# EAGLE design ARP Odyssey VCO 1.3 (EAGLE 7.7.0)
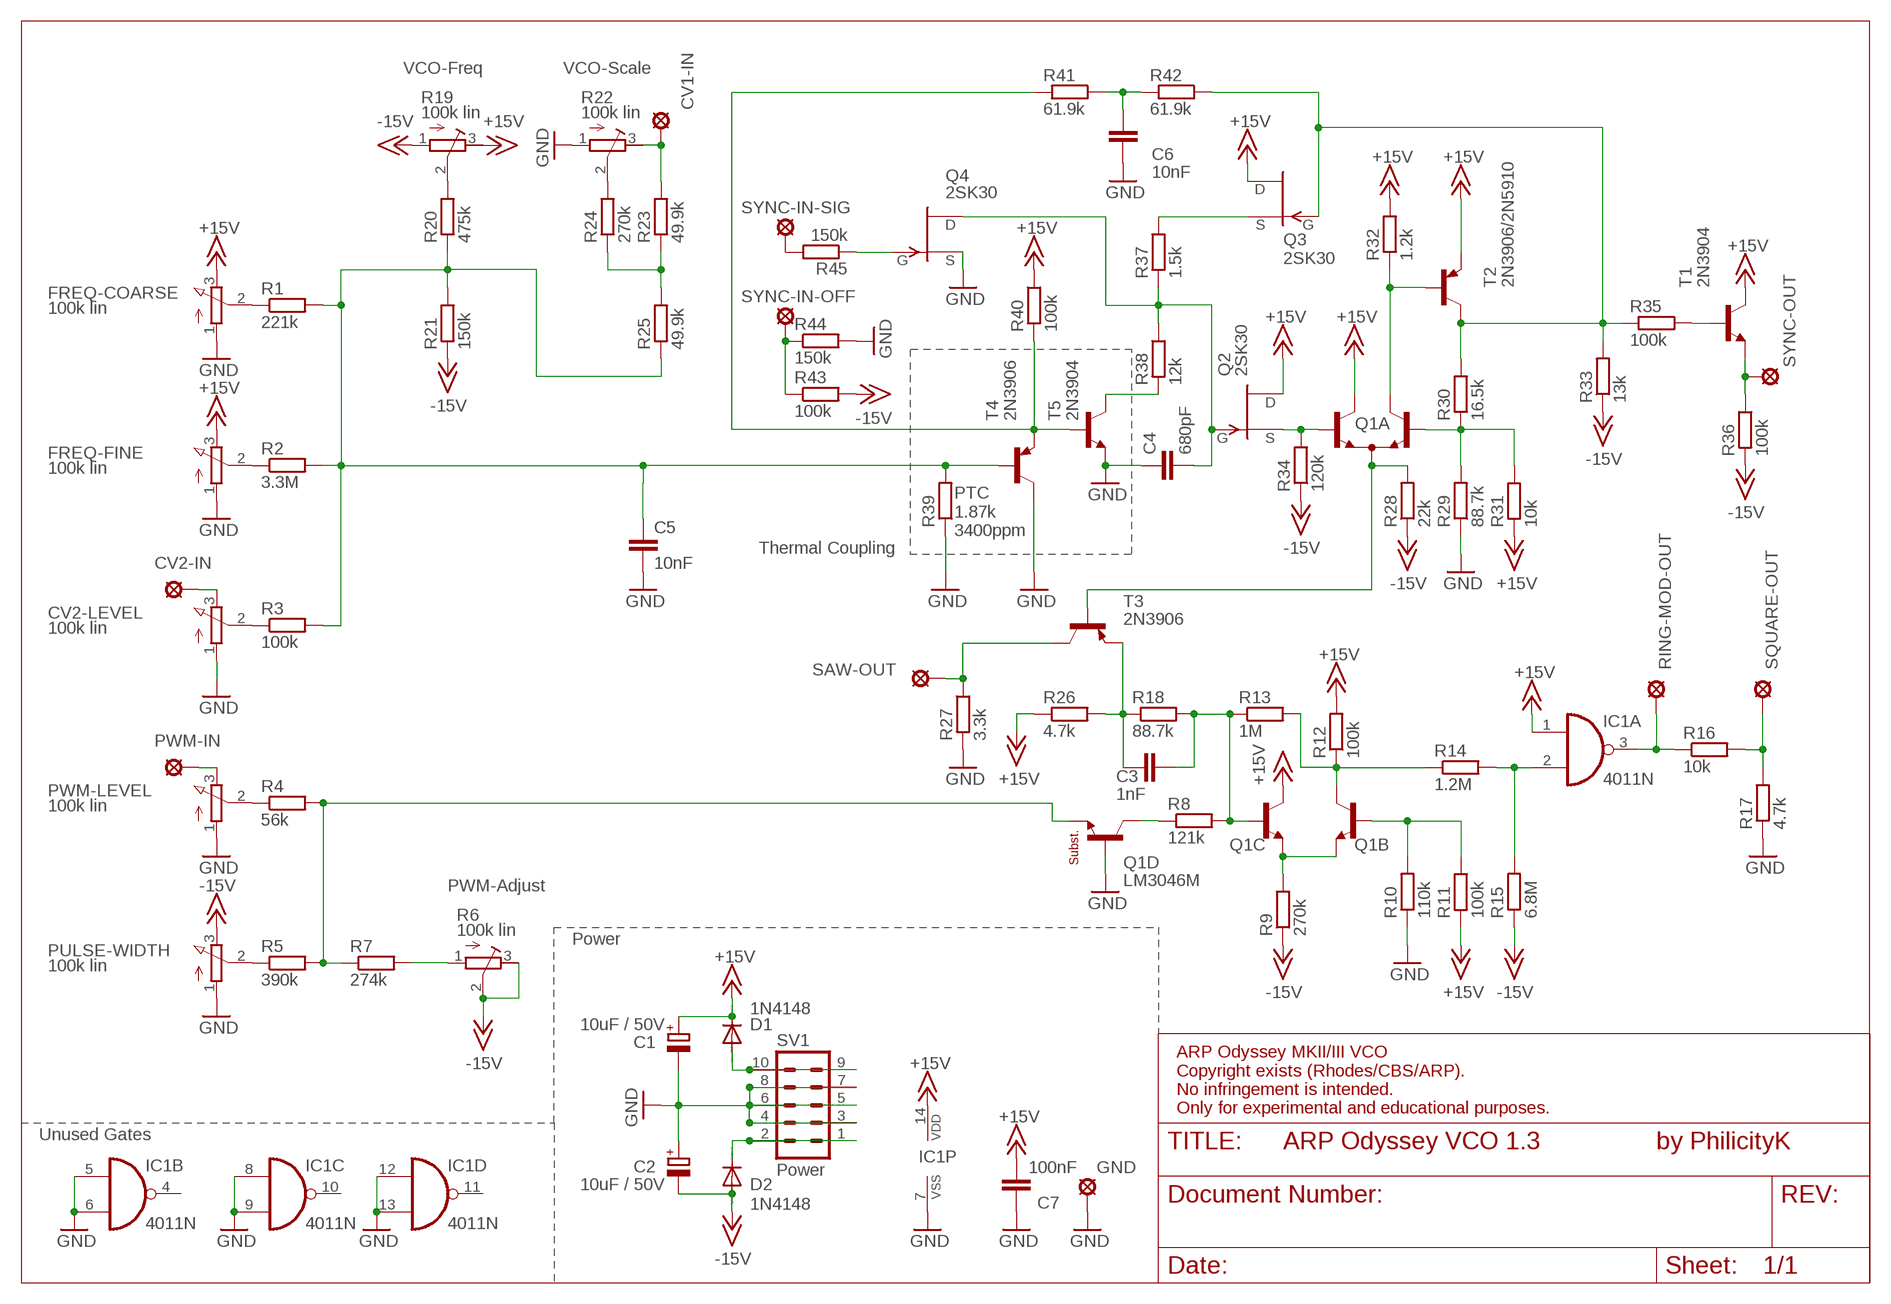
[diagram p0: schematic, sheet 1]

## Parts
C1  10uF / 50V  CPOL-EUE2,5-6E  [E2,5-6E]
C2  10uF / 50V  CPOL-EUE2,5-6E  [E2,5-6E]
C3  1nF  C-EU050-045X075  [C050-045X075]
C4  680pF  C-EU050-045X075  [C050-045X075]
C5  10nF  C-EU050-045X075  [C050-045X075]
C6  10nF  C-EU050-045X075  [C050-045X075]
C7  100nF  C-EU050-045X075  [C050-045X075]
CV1-IN  SE11  [SE11]
CV2-IN  SE11  [SE11]
CV2-LEVEL  100k lin  RK11K112  [RK11K112]
D1  1N4148  1N4148DO35-7  [DO35-7]
D2  1N4148  1N4148DO35-7  [DO35-7]
FREQ-COARSE  100k lin  RK11K112  [RK11K112]
FREQ-FINE  100k lin  RK11K112  [RK11K112]
GND  SE11  [SE11]
IC1  4011N  [DIL14]
PULSE-WIDTH  100k lin  RK11K112  [RK11K112]
PWM-IN  SE11  [SE11]
PWM-LEVEL  100k lin  RK11K112  [RK11K112]
Q1  LM3046M  LM3046M/NOPB  [SO14]
Q2  2SK30  [TO92]
Q3  2SK30  [TO92]
Q4  2SK30  [TO92]
R1  221k  R-EU_0207/7  [0207/7]
R2  3.3M  R-EU_0207/7  [0207/7]
R3  100k  R-EU_0207/7  [0207/7]
R4  56k  R-EU_0207/7  [0207/7]
R5  390k  R-EU_0207/7  [0207/7]
R6  100k lin  R-TRIMM64W  [RTRIM64W]
R7  274k  R-EU_0207/7  [0207/7]
R8  121k  R-EU_0207/7  [0207/7]
R9  270k  R-EU_0207/7  [0207/7]
R10  110k  R-EU_0207/7  [0207/7]
R11  100k  R-EU_0207/7  [0207/7]
R12  100k  R-EU_0207/7  [0207/7]
R13  1M  R-EU_0207/7  [0207/7]
R14  1.2M  R-EU_0207/7  [0207/7]
R15  6.8M  R-EU_0207/7  [0207/7]
R16  10k  R-EU_0207/7  [0207/7]
R17  4.7k  R-EU_0207/7  [0207/7]
R18  88.7k  R-EU_0207/7  [0207/7]
R19  100k lin  R-TRIMM64W  [RTRIM64W]
R20  475k  R-EU_0207/7  [0207/7]
R21  150k  R-EU_0207/7  [0207/7]
R22  100k lin  R-TRIMM64W  [RTRIM64W]
R23  49.9k  R-EU_0207/7  [0207/7]
R24  270k  R-EU_0207/7  [0207/7]
R25  49.9k  R-EU_0207/7  [0207/7]
R26  4.7k  R-EU_0207/7  [0207/7]
R27  3.3k  R-EU_0207/7  [0207/7]
R28  22k  R-EU_0207/7  [0207/7]
R29  88.7k  R-EU_0207/7  [0207/7]
R30  16.5k  R-EU_0207/7  [0207/7]
R31  10k  R-EU_0207/7  [0207/7]
R32  1.2k  R-EU_0207/7  [0207/7]
R33  13k  R-EU_0207/7  [0207/7]
R34  120k  R-EU_0207/7  [0207/7]
R35  100k  R-EU_0207/7  [0207/7]
R36  100k  R-EU_0207/7  [0207/7]
R37  1.5k  R-EU_0207/7  [0207/7]
R38  12k  R-EU_0207/7  [0207/7]
R39  PTC 1.87k  R-EU_0207/7  [0207/7]
R40  100k  R-EU_0207/7  [0207/7]
R41  61.9k  R-EU_0207/7  [0207/7]
R42  61.9k  R-EU_0207/7  [0207/7]
R43  100k  R-EU_0207/7  [0207/7]
R44  150k  R-EU_0207/7  [0207/7]
R45  150k  R-EU_0207/7  [0207/7]
RING-MOD-OUT  SE11  [SE11]
SAW-OUT  SE11  [SE11]
SQUARE-OUT  SE11  [SE11]
SV1  Power  ML10  [ML10]
SYNC-IN-OFF  SE11  [SE11]
SYNC-IN-SIG  SE11  [SE11]
SYNC-OUT  SE11  [SE11]
T1  2N3904  2N3904-NPN-TO92-EBC  [TO92-EBC]
T2  2N3906/2N5910  2N3906-PNP-TO92-EBC  [TO92-EBC]
T3  2N3906  2N3906-PNP-TO92-EBC  [TO92-EBC]
T4  2N3906  2N3906-PNP-TO92-EBC  [TO92-EBC]
T5  2N3904  2N3904-NPN-TO92-EBC  [TO92-EBC]

## Nets
+15V: C1.+ C7.2 D1.C FREQ-COARSE.3(E) FREQ-FINE.3(E) IC1.1(A:I0) IC1.14(P:VDD) Q1.5(A:C2) Q1.11(C:C) Q2.3(D) Q3.3(D) R11.2 R12.2 R19.3(E) R26.1 R31.2 R32.2 R40.1 T1.C T2.E
-15V: C2.- D2.A PULSE-WIDTH.3(E) R6.2(S) R6.3(E) R9.1 R15.1 R19.1(A) R21.2 R28.1 R33.1 R34.1 R36.2 R43.2
GND: C1.- C2.+ C4.1 C5.2 C6.2 C7.1 CV2-LEVEL.1(A) FREQ-COARSE.1(A) FREQ-FINE.1(A) GND.MP IC1.5(B:I0) IC1.6(B:I1) IC1.7(P:VSS) IC1.8(C:I0) IC1.9(C:I1) IC1.12(D:I0) IC1.13(D:I1) PULSE-WIDTH.1(A) PWM-LEVEL.1(A) Q1.12(D:B) Q4.1(S) R10.1 R17.1 R22.1(A) R27.2 R29.1 R39.1 R44.2 SV1.3 SV1.4 SV1.5 SV1.6 SV1.7 SV1.8 T4.C T5.E
N$1: D2.C SV1.1 SV1.2
N$2: FREQ-COARSE.2(S) R1.1
N$3: FREQ-FINE.2(S) R2.1
N$4: C5.1 R1.2 R2.2 R3.2 R20.2 R21.1 R25.2 R39.2 T4.B
N$5: D1.A SV1.9 SV1.10
N$6: CV2-LEVEL.2(S) R3.1
N$7: CV2-IN.MP CV2-LEVEL.3(E)
N$8: PWM-IN.MP PWM-LEVEL.3(E)
N$9: PWM-LEVEL.2(S) R4.1
N$10: PULSE-WIDTH.2(S) R5.1
N$11: Q1.13(D:E) R4.2 R5.2 R7.1
N$12: R6.1(A) R7.2
N$13: Q1.14(D:C) R8.1
N$14: C3.2 Q1.9(C:B) R8.2 R13.1 R18.2
N$15: Q1.7(B:E) Q1.10(C:E) R9.2
N$16: Q1.6(B:B) R10.2 R11.1
N$17: Q1.8(B:C) R12.1 R13.2 R14.1
N$18: IC1.2(A:I1) R14.2 R15.2
N$19: IC1.3(A:O) R16.1 RING-MOD-OUT.MP
N$20: R16.2 R17.2 SQUARE-OUT.MP
N$21: C3.1 R18.1 R26.2 T3.E
N$22: R19.2(S) R20.1
N$23: R22.2(S) R24.1
N$24: R23.2 R24.2 R25.1
N$25: CV1-IN.MP R22.3(E) R23.1
N$26: Q1.3(A:E) R28.2 T3.B
N$27: R27.1 SAW-OUT.MP T3.C
N$28: Q1.2(A:B1) R29.2 R30.1 R31.1
N$29: Q3.2(G) R30.2 R33.2 R35.2 R42.1 T2.C
N$30: Q1.1(A:C1) R32.1 T2.B
N$31: Q1.4(A:B2) Q2.1(S) R34.2
N$32: R36.1 SYNC-OUT.MP T1.E
N$33: R35.1 T1.B
N$34: Q3.1(S) R37.1
N$35: C6.1 R41.1 R42.2
N$36: R38.2 T5.C
N$38: R40.2 R41.2 T4.E T5.B
N$39: R43.1 R44.1 SYNC-IN-OFF.MP
N$40: Q4.2(G) R45.1
N$41: R45.2 SYNC-IN-SIG.MP
N$42: C4.2 Q2.2(G) Q4.3(D) R37.2 R38.1
Unconnected: IC1.4(B:O) IC1.10(C:O) IC1.11(D:O)

## Notes on the sheet
- VCO-Freq | VCO-Scale
- PTC
  1.87k
  3400ppm
- Thermal Coupling
- PWM-Adjust
- Power
- ARP Odyssey MKII/III VCO
  Copyright exists (Rhodes/CBS/ARP).
  No infringement is intended.
  Only for experimental and educational purposes.
- Unused Gates
- by PhilicityK

## Library data of the parts
C1 C2 = rcl:CPOL-EU: POLARIZED CAPACITOR, European symbol
C3-C7 = rcl:C-EU: CAPACITOR, European symbol
CV1-IN CV2-IN GND PWM-IN RING-MOD-OUT SAW-OUT SQUARE-OUT SYNC-IN-OFF SYNC-IN-SIG SYNC-OUT = solpad:SE11: SOLDER PAD RTM, drill 1,1mm, distributor Buerklin, 07F810
CV2-LEVEL FREQ-COARSE FREQ-FINE PULSE-WIDTH PWM-LEVEL = alps-potentiometers:RK11K112
D1 D2 = diode:1N4148: DIODE high speed (Philips)
IC1 = 40xx:4011: Quad 2-input NAND
Q1 = nh-ic:LM3046: Texas Instruments LM3046 According to datasheet http://www.ti.com/lit/ds/symlink/lm3046.pdf. Created by Nils Hintze <n.hintze@elektronikpage.net>
Q2-Q4 = Philip:2SK30
R1-R5 R7-R18 R20 R21 R23-R45 = rcl:R-EU_: RESISTOR, European symbol
R6 R19 R22 = rcl:R-TRIMM: Trimm resistor
SV1 = con-harting-ml:ML10: HARTING; OC_FARNELL: unknown; OC_NEWARK: unknown
T1 T5 = transistor-neu-to92:*-NPN-: NPN Transistror
T2-T4 = transistor-neu-to92:*-PNP-: PNP Transistror

## Board
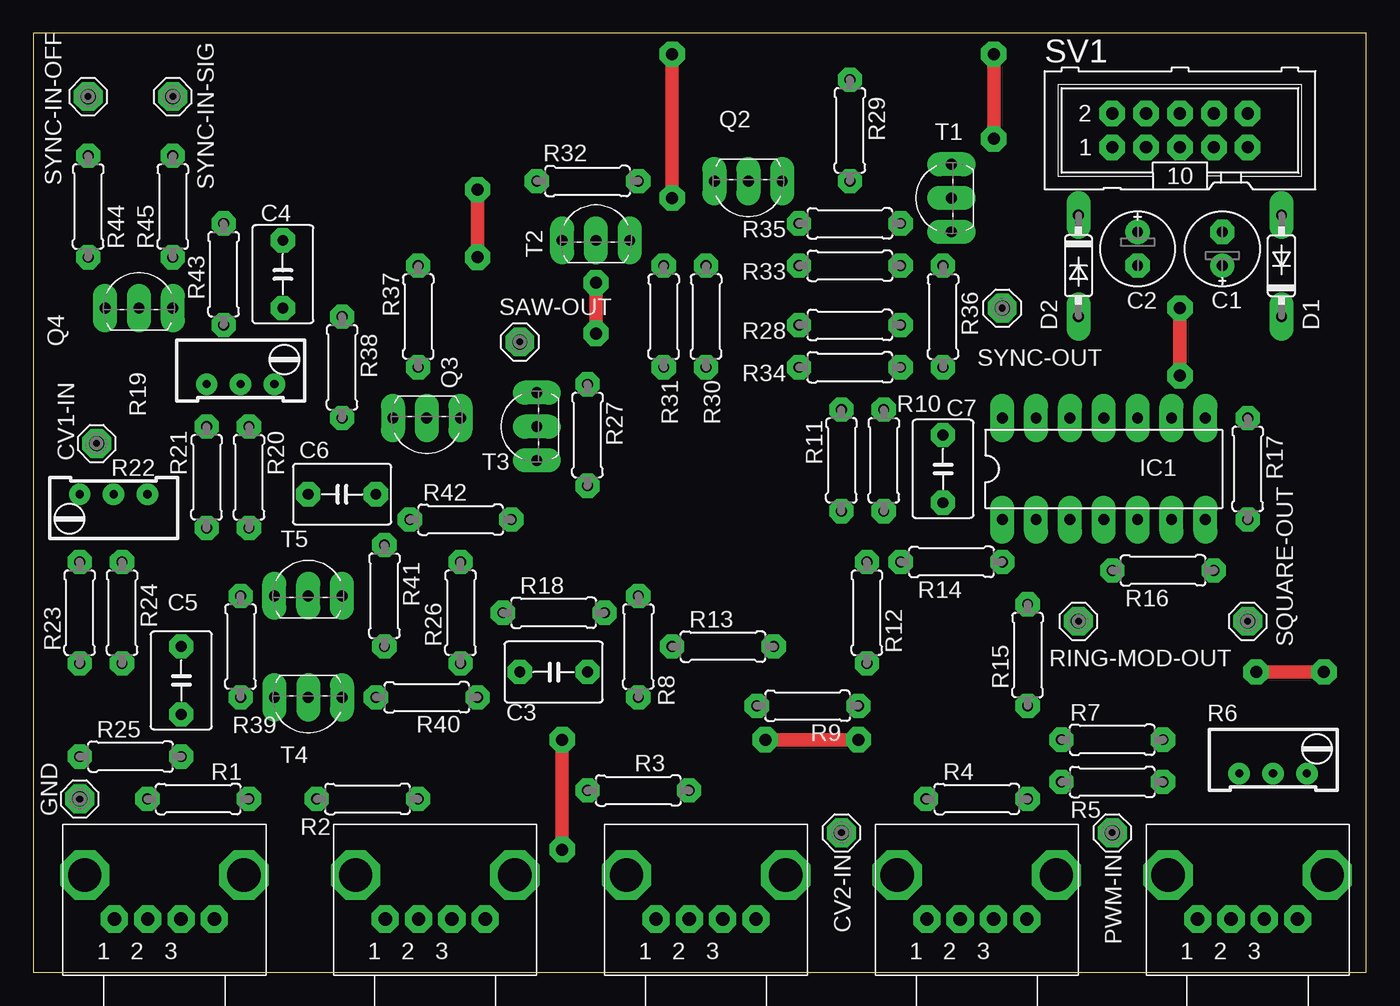
[diagram p1: board, top side]
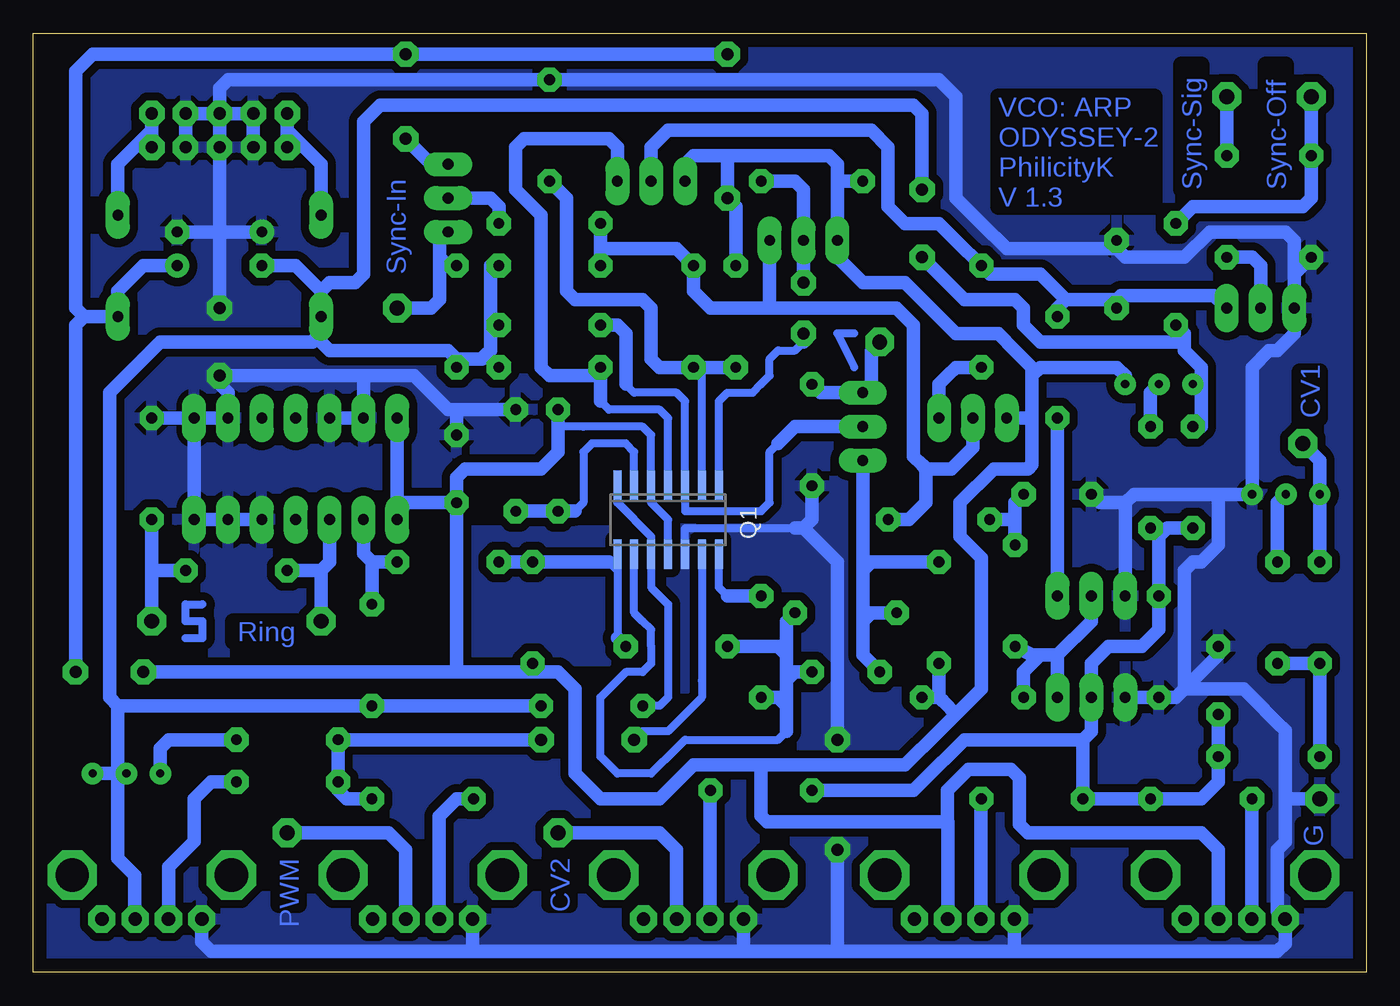
[diagram p2: board, bottom side, seen from below]

Size 100 x 70.47 mm. Coordinates in mm from the lower left corner, seen from the top.
Outline: 100,0 100,70.47 0,70.47 0,0 100,0
Copper layers (1*16): Top 0.035mm / dielectric 1.5mm / Bottom 0.035mm
Design rules "default *": minimum track width 10mil, minimum drill 24mil, track to track 0.3mm, track to pad 0.3mm, pad to pad 0.3mm, via to via 0.3mm, smd to smd 8mil, copper to edge 40mil, drill to drill 8mil, minimum pad ring 0.5mm, minimum via ring 0.5mm, stop-mask expansion 4mil, vias tented up to drill 0mil, thermal gap 0.4mm

### Footprints (pad centres in the part's own frame; a part is rotated, then mirrored left to right if it is on the bottom)
E2,5-6E = drill 0.813 pad 1.575: + -1.27,0 | drill 0.813 pad 1.575 octagon: - 1.27,0
C050-045X075 = drill 0.813 octagon: 1 -2.54,0; 2 2.54,0
SE11 = drill 1.118 pad 2.159 octagon: MP 0,0
RK11K112 = drill 1 pad 2.032 octagon: 1 -3.75,-3.3; 2 -1.25,-3.3; 3 1.25,-3.3; P$4 3.75,-3.3 | drill 2.5 pad 3.5 octagon: P$5 -5.969,0; P$6 5.969,0
DO35-7 = drill 0.813 long: A 3.81,0; C -3.81,0
DIL14 = drill 0.813 long: 1 -7.62,-3.81; 2 -5.08,-3.81; 3 -2.54,-3.81; 4 0,-3.81; 5 2.54,-3.81; 6 5.08,-3.81; 7 7.62,-3.81; 8 7.62,3.81; 9 5.08,3.81; 10 2.54,3.81; 11 0,3.81; 12 -2.54,3.81; 13 -5.08,3.81; 14 -7.62,3.81
SO14 = smd 0.6 x 2.2: 1 -3.81,-2.6; 2 -2.54,-2.6; 3 -1.27,-2.6; 4 0,-2.6; 5 1.27,-2.6; 6 2.54,-2.6; 7 3.81,-2.6; 8 3.81,2.6; 9 2.54,2.6; 10 1.27,2.6; 11 0,2.6; 12 -1.27,2.6; 13 -2.54,2.6; 14 -3.81,2.6
TO92 = drill 0.813 long: 1 -2.54,-1.27; 2 0,-1.27; 3 2.54,-1.27
0207/7 = drill 0.813 octagon: 1 -3.81,0; 2 3.81,0
RTRIM64W = drill 0.61: 1 1.27,-2.54; 2 1.27,0; 3 1.27,2.54
ML10 = drill 0.914 octagon: 1 -5.08,-1.27; 2 -5.08,1.27; 3 -2.54,-1.27; 4 -2.54,1.27; 5 0,-1.27; 6 0,1.27; 7 2.54,-1.27; 8 2.54,1.27; 9 5.08,-1.27; 10 5.08,1.27
TO92-EBC = drill 0.813 long: B 0,-1.27; C 2.54,-1.27; E -2.54,-1.27

### Placement (x,y rotation side)
C1  89.2,54.29 90 top
C2  82.86,54.29 270 top
C3  39.04,22.54 0 top
C4  18.72,52.39 270 top
C5  11.1,21.91 90 top
C6  23.16,35.88 180 top
C7  68.25,37.78 270 top
CV1-IN  4.75,39.69 90 top
CV2-IN  60.63,10.48 90 top
CV2-LEVEL  50.47,7.3 0 top
D1  93.65,53.02 90 top
D2  78.41,53.02 270 top
FREQ-COARSE  9.83,7.3 0 top
FREQ-FINE  30.15,7.3 0 top
GND  3.48,13.02 90 top
IC1  80.31,37.78 0 top
PULSE-WIDTH  91.11,7.3 0 top
PWM-IN  80.95,10.48 90 top
PWM-LEVEL  70.79,7.3 0 top
Q1  52.38,33.97 180 bottom
Q2  53.65,58.1 180 top
Q3  29.52,40.32 180 top
Q4  7.92,51.12 0 top
R1  12.37,13.02 0 top
R2  25.07,13.02 180 top
R3  45.39,13.65 180 top
R4  70.79,13.02 0 top
R5  80.95,14.29 180 top
R6  93.02,16.19 270 top
R7  80.95,17.46 0 top
R8  45.39,24.45 270 top
R9  58.09,20 180 top
R10  63.8,38.42 270 top
R11  60.63,38.42 90 top
R12  62.53,26.99 270 top
R13  51.74,24.45 0 top
R14  68.89,30.8 0 top
R15  74.6,23.81 90 top
R16  84.76,30.16 0 top
R17  91.11,37.78 270 top
R18  39.04,26.99 0 top
R19  15.54,45.4 270 top
R20  16.18,37.15 270 top
R21  13.01,37.15 90 top
R22  6.02,34.61 90 top
R23  3.48,26.99 270 top
R24  6.66,26.99 270 top
R25  7.29,16.19 0 top
R26  32.05,26.99 90 top
R27  41.58,40.32 270 top
R28  61.27,48.58 180 top
R29  61.27,63.18 270 top
R30  50.47,49.21 90 top
R31  47.3,49.21 90 top
R32  41.58,59.37 180 top
R33  61.27,53.02 180 top
R34  61.27,45.4 180 top
R35  61.27,56.2 180 top
R36  68.25,49.21 270 top
R37  28.88,49.21 90 top
R38  23.16,45.4 270 top
R39  15.54,24.45 90 top
R40  29.52,20.64 180 top
R41  26.34,28.26 270 top
R42  32.05,33.97 180 top
R43  14.28,52.39 270 top
R44  4.12,57.47 270 top
R45  10.46,57.47 90 top
RING-MOD-OUT  78.41,26.35 90 top
SAW-OUT  36.5,47.31 90 top
SQUARE-OUT  91.11,26.35 90 top
SV1  86.03,63.18 0 top
SYNC-IN-OFF  4.12,65.72 90 top
SYNC-IN-SIG  10.46,65.72 90 top
SYNC-OUT  72.69,49.85 90 top
T1  67.61,58.1 90 top
T2  42.22,56.2 0 top
T3  36.5,40.96 90 top
T4  20.62,19.37 180 top
T5  20.62,29.53 0 top

### Tracks (layer width: path | path; a pad name or v marks a point on that pad's centre or on a via)
+15V  (via drill 0.9 pad 1.78)
  Top 1: v96.83,22.54 v91.75,22.54 | v47.93,68.9 v47.93,58.1 | v72.06,62.55 v72.06,68.9
  Bottom 0.61: Q1.11 52.38,33.97 53.65,35.24 Q1.5 53.65,40.32 54.28,40.96 58.73,40.96 60.63,40.96 60.63,39.69
  Bottom 0.813: 32.05,20.64 31.74,20.32 | 39.04,53.02 39.67,53.66
  Bottom 1: IC1.1 72.69,35.24 | 72.69,35.24 IC1.14 | FREQ-COARSE.3 11.08,9.19 12.37,10.48 25.4,10.48 26.04,11.11 26.04,14.61 26.67,15.24 29.84,15.24 30.16,14.92 30.8,14.29 31.43,13.65 31.43,11.34 31.4,11.31 | FREQ-FINE.3 31.4,11.31 | 31.4,11.31 44.95,11.31 45.39,11.75 45.39,14.29 45.39,15.56 | 94.92,49.21 D1.C 93.65,51.12 91.75,53.02 C1.+ | v96.83,22.54 96.83,46.04 96.83,46.67 96.83,48.58 96.19,49.21 | 45.39,15.56 50.47,15.56 51.74,14.29 53.01,13.02 57.45,13.02 59.36,14.92 59.36,21.27 60.63,22.54 62.53,22.54 | R19.3 18.09,44.77 18.72,45.4 24.43,45.4 25.07,44.77 | 45.39,15.56 34.59,15.56 32.05,18.1 31.42,18.73 30.79,19.37 | 25.07,41.59 25.07,38.42 25.07,38.11 25.4,37.78 27.94,37.78 30.48,35.24 30.48,32.7 29.21,31.43 28.88,31.1 28.88,23.81 28.88,21.91 28.88,21.27 30.79,19.37 | 25.07,41.59 25.07,44.77 | v91.75,22.54 70.79,22.54 68.25,22.54 | 68.25,22.54 62.53,22.54 | R40.1 32.05,20.64 | 30.79,19.37 31.74,20.32 32.05,20.64 | R12.2 62.53,22.54 | R11.2 60.63,40.96 60.63,40.32 60.63,39.69 60.63,39.05 61.9,37.78 67.61,37.78 68.25,37.15 C7.2 | Q3.3 25.07,41.59 | R26.1 32.05,20.64 | 94.92,49.21 96.19,49.21 | 96.19,49.21 96.83,49.85 96.83,67.63 95.56,68.9 v72.06,68.9 v47.93,68.9 | 39.67,56.83 T2.E 39.67,53.66 39.04,53.02 37.77,51.75 34.59,51.75 32.69,49.85 30.79,47.94 27.61,47.94 26.34,46.67 25.07,45.4 25.07,44.77 | 39.67,56.83 39.67,59.37 | 39.67,59.37 39.04,59.37 R32.2 | 39.67,59.37 39.67,60.64 40.31,61.28 47.93,61.28 | Q2.3 51.1,60.64 50.47,61.28 47.93,61.28 | R31.2 47.3,57.47 | 47.3,57.47 v47.93,58.1 | v47.93,58.1 47.93,59.37 | 47.93,59.37 47.93,61.28 | 47.3,57.47 v47.93,58.1 | v47.93,58.1 47.93,58.74 47.93,59.37
  Bottom 1: T1.C 70.16,60.64 v72.06,62.55 | 39.67,56.83 39.67,56.2 | 96.19,49.21 94.92,49.21 | C7.2 68.25,22.54 | C7.2 72.69,35.24
-15V  (via drill 0.9 pad 1.78)
  Top 1: v33.33,53.66 v33.33,58.74
  Bottom 1: PULSE-WIDTH.3 92.38,4.02 92.38,7.3 93.65,8.57 93.65,13.65 93.65,14.92 | 13.64,47.31 13.64,46.67 13.01,46.04 12.37,45.4 12.37,44.13 | 13.64,47.31 13.64,47.94 R43.2 | 13.64,47.31 24.43,47.31 25.07,47.94 25.7,48.58 25.7,49.85 26.34,50.48 28.88,50.48 30.15,50.48 v33.33,53.66 | 12.37,44.13 12.37,40.96 R21.2 | R19.1 12.37,44.13 | 68.25,46.04 66.34,46.04 66.03,46.35 | 66.03,46.35 65.71,46.67 65.71,48.58 | 65.71,48.58 65.71,53.02 R33.1 | R36.2 68.25,46.04 | R34.1 66.03,46.35 | R28.1 65.71,48.58 | R9.1 62.53,20 R15.1 93.65,20 | 93.65,20 94.28,20.64 94.28,24.45 94.28,25.72 94.28,43.5 92.38,45.4 90.47,47.31 79.05,47.31 78.73,47.62 | 78.73,47.62 78.41,47.94 D2.A 78.41,49.85 78.41,51.12 | 93.65,20 93.65,16.19 93.65,14.92 | 78.41,51.12 77.78,51.75 75.87,51.75 75.23,52.39 75.23,63.82 73.97,65.09 36.5,65.09 33.96,65.09 33.33,64.45 v33.33,58.74 | 68.25,46.04 68.89,46.67 77.78,46.67 78.73,47.62 | C2.- 80.31,53.02 78.41,51.12 | R6.2 93.65,14.92 | 93.65,14.92 R6.3
  Bottom 1.016: 78.41,50.48 78.41,49.85
GND  (via drill 0.9 pad 1.78)
  Top 1: v39.67,9.21 v39.67,17.46 | v86.03,49.85 v86.03,44.77
  Bottom 0.61: Q1.12 51.1,33.34 42.85,33.34
  Bottom 0.813: R29.1 60.63,66.99
  Bottom 1: SV1.7 SV1.8 SV1.6 | SV1.6 SV1.5 86.03,58.74 86.03,56.83 86.03,55.56 | SV1.3 SV1.4 SV1.6 | T4.C 16.18,20.64 R39.1 14.28,20.64 13.64,21.27 | IC1.5 IC1.6 IC1.7 IC1.8 | 11.1,35.88 R22.1 8.56,45.4 7.29,46.67 6.66,46.67 5.38,47.94 Q4.1 5.38,50.48 5.38,52.39 | 11.1,35.88 17.45,35.88 18.09,35.24 | 18.09,35.24 T5.E | 13.64,21.27 13.64,30.16 13.01,30.8 12.37,30.8 11.1,32.07 11.1,35.88 | 13.64,21.27 9.2,21.27 8.56,20.64 6.66,18.73 6.08,18.16 6.08,13.02 | C5.2 11.1,23.81 13.64,21.27 | 18.09,35.24 19.99,35.24 C6.2 | 18.72,54.29 18.09,53.66 15.54,53.66 13.64,53.66 11.73,55.56 6.02,55.56 5.38,54.93 5.38,52.39 | 18.72,54.29 C4.1 | 39.67,1.59 v39.67,9.21 | v39.67,17.46 39.67,30.8 42.22,33.34 | 42.22,33.34 42.85,33.34 | R27.2 41.58,33.97 42.22,33.34 | 86.03,55.56 v86.03,49.85 | 26.34,1.59 6.66,1.59 6.08,2.16 FREQ-COARSE.1 6.66,4.58 6.66,9.21 6.08,9.78 6.08,13.02 | 26.34,1.59 39.67,1.59 | FREQ-FINE.1 26.4,1.65 26.34,1.59 | 39.67,1.59 46.66,1.59 | 46.66,1.59 66.98,1.59 | 66.98,1.59 82.22,1.59 86.67,1.59 87.36,2.28 PULSE-WIDTH.1 | PWM-LEVEL.1 67.04,1.65 66.98,1.59 | CV2-LEVEL.1 46.72,1.65 46.66,1.59 | SV1.6 86.03,66.36 85.39,66.99 R29.1 60.63,66.99 49.2,66.99 32.05,66.99 30.79,65.72 30.79,58.1 28.88,56.2 26.98,54.29 25.7,54.29 22.53,54.29 18.72,54.29 | GND.MP 6.08,13.02 | C2.+ 86.03,55.56 | 86.03,55.56 C1.- | 5.38,52.39 R44.2 | R10.1 68.25,42.23 | 68.25,42.23 68.89,42.23 71.42,44.77 75.23,44.77 | 87.3,41.59 IC1.9 85.39,43.5 86.03,44.13 v86.03,44.77 75.23,44.77 | 87.3,41.59 IC1.8 | R17.1 IC1.8 | IC1.8 87.3,41.59 | IC1.12 IC1.13 75.23,44.77 | C7.1 68.25,42.23
  pour Bottom (isolate 0.61): -0.33,-0.32 -0.33,70.48 100,70.48 100,-0.32
N$1
  Bottom 1: SV1.1 80.95,63.18 | 80.95,63.18 SV1.2 | D2.C 78.41,60.64 80.95,63.18
N$2
  Bottom 1: FREQ-COARSE.2 8.58,13 R1.1
N$3
  Bottom 1: FREQ-FINE.2 28.9,13 R2.1
N$4
  Bottom 1: R3.2 33.96,13.65 32.69,14.92 30.79,16.83 30.15,17.46 21.26,17.46 | 15.54,32.7 R39.2 15.54,25.72 16.82,24.45 19.36,24.45 20.62,23.18 T4.B 20.62,18.1 21.26,17.46 | 15.54,32.7 14.91,33.34 R21.1 | R20.2 15.54,32.7 | C5.1 R25.2 11.1,14.29 12.37,13.02 R1.2 20.62,13.02 R2.2 21.26,17.46
N$5
  Bottom 1: SV1.9 91.11,63.18 | 91.11,63.18 SV1.10 | D1.A 93.65,60.64 91.11,63.18
N$6
  Bottom 1: CV2-LEVEL.2 49.22,13.63 R3.1
N$7
  Bottom 1: CV2-IN.MP 53.01,10.48 51.74,9.21 51.74,4.02 CV2-LEVEL.3
N$8
  Bottom 1: PWM-IN.MP 73.33,10.48 72.06,9.21 72.06,4.02 PWM-LEVEL.3
N$9
  Bottom 1: PWM-LEVEL.2 69.54,11.73 68.25,13.02 R4.1
N$10
  Bottom 1: R5.1 86.67,14.29 87.94,13.02 87.94,9.84 89.84,7.94 89.84,4.02 PULSE-WIDTH.2
N$11  (via drill 0.9 pad 1.78)
  Top 1: v54.91,17.46 v61.9,17.46
  Bottom 0.61: Q1.13 49.84,21.91 49.84,20.64 51.1,19.37 52.38,18.1 54.28,18.1 v54.91,17.46
  Bottom 1: R4.2 76.5,13.02 77.14,13.65 R5.2 R7.1 v61.9,17.46
N$12
  Bottom 1: R6.1 90.47,16.83 89.84,17.46 R7.2
N$13
  Bottom 0.61: 47.93,28.26 48.56,28.89 Q1.14
  Bottom 1: 47.93,28.26 R8.1
N$14
  Bottom 0.61: 43.48,18.1 44.12,17.46 51.1,17.46 51.74,16.83 53.65,14.92 56.19,14.92 57.45,16.19 57.45,20.64 56.19,21.91 55.55,22.54 54.28,22.54 53.65,23.18 53.65,24.45 53.65,25.72 54.28,26.35 54.91,26.99 Q1.9
  Bottom 1: 43.48,18.1 43.48,20 | 43.48,20 43.48,21.91 | 43.48,21.91 43.48,23.81 | 43.48,23.81 43.48,26.35 R18.2 | R13.1 44.12,24.45 43.48,23.81 | C3.2 42.85,22.54 43.48,21.91 | R8.2 44.12,20.64 43.48,20
N$15
  Bottom 0.61: Q1.7 56.19,35.24 53.65,32.7 Q1.10 53.65,28.89 52.38,27.62 52.38,25.08 52.38,20.64 53.01,20 R9.2
N$16
  Bottom 0.61: Q1.6 54.91,39.05 55.55,39.69 58.09,39.69 58.73,39.05 58.73,35.24 59.36,34.61
  Bottom 0.813: R11.1 R10.2
  Bottom 1: 59.36,34.61 R10.2
N$17
  Bottom 0.61: Q1.8 56.19,30.16 | 56.19,30.16 56.19,25.08 | 56.82,30.8 56.19,30.16
  Bottom 1: R14.1 R12.1 56.82,30.8 | 56.19,25.08 R13.2
N$18
  Bottom 1: R15.2 74.6,30.8 | 74.6,30.8 75.23,31.43 IC1.2 | R14.2 74.6,30.8
N$19
  Bottom 1: IC1.3 77.78,30.8 78.41,30.16 | 78.41,30.16 R16.1 | RING-MOD-OUT.MP 78.41,30.16
N$20
  Bottom 1: SQUARE-OUT.MP 91.11,30.16 | 91.11,30.16 R17.2 | R16.2 91.11,30.16
N$21
  Bottom 1: T3.E 37.77,30.16 | 37.77,30.16 37.77,26.35 | 37.77,26.35 37.77,23.81 C3.1 | R18.1 37.13,26.99 37.77,26.35 | R26.2 37.13,30.8 37.77,30.16
N$22
  Bottom 1: R20.1 16.18,43.5 R19.2
N$23
  Bottom 1: R24.1 6.66,35.24 R22.2
N$24
  Bottom 1: R25.1 R23.2 R24.2
N$25
  Bottom 1: R23.1 R22.3 3.48,38.42 CV1-IN.MP
N$26
  Bottom 0.61: 44.12,39.69 44.76,39.05 44.76,35.24 45.39,34.61 51.1,34.61 Q1.3 51.1,42.86 51.74,43.5 54.91,43.5 55.55,44.13
  Bottom 1: 44.12,39.69 42.85,40.96 T3.B | 55.55,44.13 55.55,47.94 56.19,48.58 R28.2
N$27
  Bottom 1: R27.1 40.95,43.5 39.04,43.5 T3.C 37.13,44.13 37.13,45.4 37.13,46.67 SAW-OUT.MP
N$28
  Bottom 0.61: Q1.2 49.84,43.5 49.84,45.4
  Bottom 1: R31.1 49.84,45.4 R30.1 53.01,45.4 53.65,46.04 53.65,49.85 54.28,50.48 59.36,50.48 59.99,51.12 59.99,58.1 R29.2
N$29
  Bottom 1: Q3.2 29.52,40.32 29.52,39.38 31.11,37.78 32.38,37.78 33.02,37.78 | R33.2 57.45,54.29 | 57.45,54.29 R35.2 | 44.76,49.85 48.56,49.85 49.2,49.85 50.47,51.12 R30.2 51.74,54.29 57.45,54.29 | 44.76,49.85 41.58,49.85 40.95,49.85 37.13,49.85 35.23,49.85 33.96,48.58 33.96,44.77 33.96,39.05 33.96,38.72 33.34,38.1 | T2.C 44.76,49.85 | 33.34,38.1 33.02,37.78 | 33.02,37.78 33.34,38.1 | R42.1 34.29,33.97 33.02,35.24 33.02,37.78
N$30  (via drill 0.9 pad 1.78)
  Top 1: v42.22,51.75 v42.22,47.94
  Bottom 0.61: Q1.1 48.56,42.86 47.93,43.5 46.02,43.5 45.39,44.13 44.76,44.77 44.76,46.04 44.12,46.67 42.85,46.67 42.22,47.31
  Bottom 1: R32.1 42.85,59.37 42.22,58.74 T2.B v42.22,51.75 | v42.22,47.94 42.22,47.31
N$31
  Bottom 0.61: Q1.4 52.38,41.59 53.01,42.23 56.82,42.23 57.45,42.86
  Bottom 1: 57.45,42.86 57.45,44.13 57.45,44.77 | 57.45,44.77 R34.2 | 57.45,44.77 61.27,44.77 61.9,45.4 61.9,56.83 63.8,58.74 63.8,61.91 63.17,62.55 56.82,62.55 56.19,61.91 Q2.1
N$32
  Bottom 1: R36.1 68.89,53.02 69.52,53.66 | 69.52,53.66 69.52,54.93 T1.E | 69.52,53.66 69.52,50.48 70.16,49.85 SYNC-OUT.MP
N$33
  Bottom 1: R35.1 65.08,57.47 65.71,58.1 T1.B
N$34
  Bottom 1: Q3.1 32.05,44.13 31.42,44.77 30.79,45.4 R37.1
N$35
  Bottom 1: R41.1 26.34,33.97 | 26.34,33.97 26.34,35.24 C6.1 | R42.2 26.34,33.97
N$36
  Bottom 1: T5.C R38.2
N$37
  Bottom 0.61: 88.57,25.08 87.3,25.08 87.3,26.35 88.57,26.35 88.57,27.62 87.3,27.62
N$38
  Bottom 1: T4.E 23.16,23.81 | 23.16,23.81 20.62,26.35 T5.B | R41.2 25.07,23.81 24.43,23.81 | 23.16,23.81 24.43,23.81 | R40.2 25.7,22.54 24.43,23.81
N$39
  Bottom 1: SYNC-IN-OFF.MP R44.1 4.12,58.1 4.75,57.47 11.73,57.47 13.01,57.47 R43.1
N$40
  Bottom 1: Q4.2 7.92,51.75 7.92,53.02 8.56,53.66 R45.1
N$41
  Bottom 1: SYNC-IN-SIG.MP R45.2
N$42
  Bottom 1: Q4.3 11.1,50.48 11.11,50.48 11.43,50.8 18.4,50.8 18.72,50.48 | 18.72,50.48 22.53,50.48 | 22.53,50.48 23.16,49.85 R38.1 | C4.2 18.72,50.48 | 22.53,50.48 24.43,52.39 25.7,52.39 26.98,52.39 28.25,52.39 R37.2 30.79,54.93 32.05,56.2 33.33,56.2 33.96,56.2 34.59,56.2 35.87,57.47 35.87,61.91 37.13,63.18 52.38,63.18 53.65,61.91 Q2.2
N$43
  Bottom 0.61: 38.41,47.94 39.67,47.94 38.41,45.4
N$44
  pour Bottom (isolate 0.61): 56.82,23.18 68.89,23.18 68.89,33.34 56.82,33.34

### Text on the board
Bottom: Sync-Off | Sync-Sig | VCO: ARP / ODYSSEY-2 / PhilicityK / V 1.3 | Sync-In | CV1 | Ring | G | CV2 | PWM
Document: Thermal Coupling